# EAGLE design fever meter v2 (EAGLE 9.3.0)
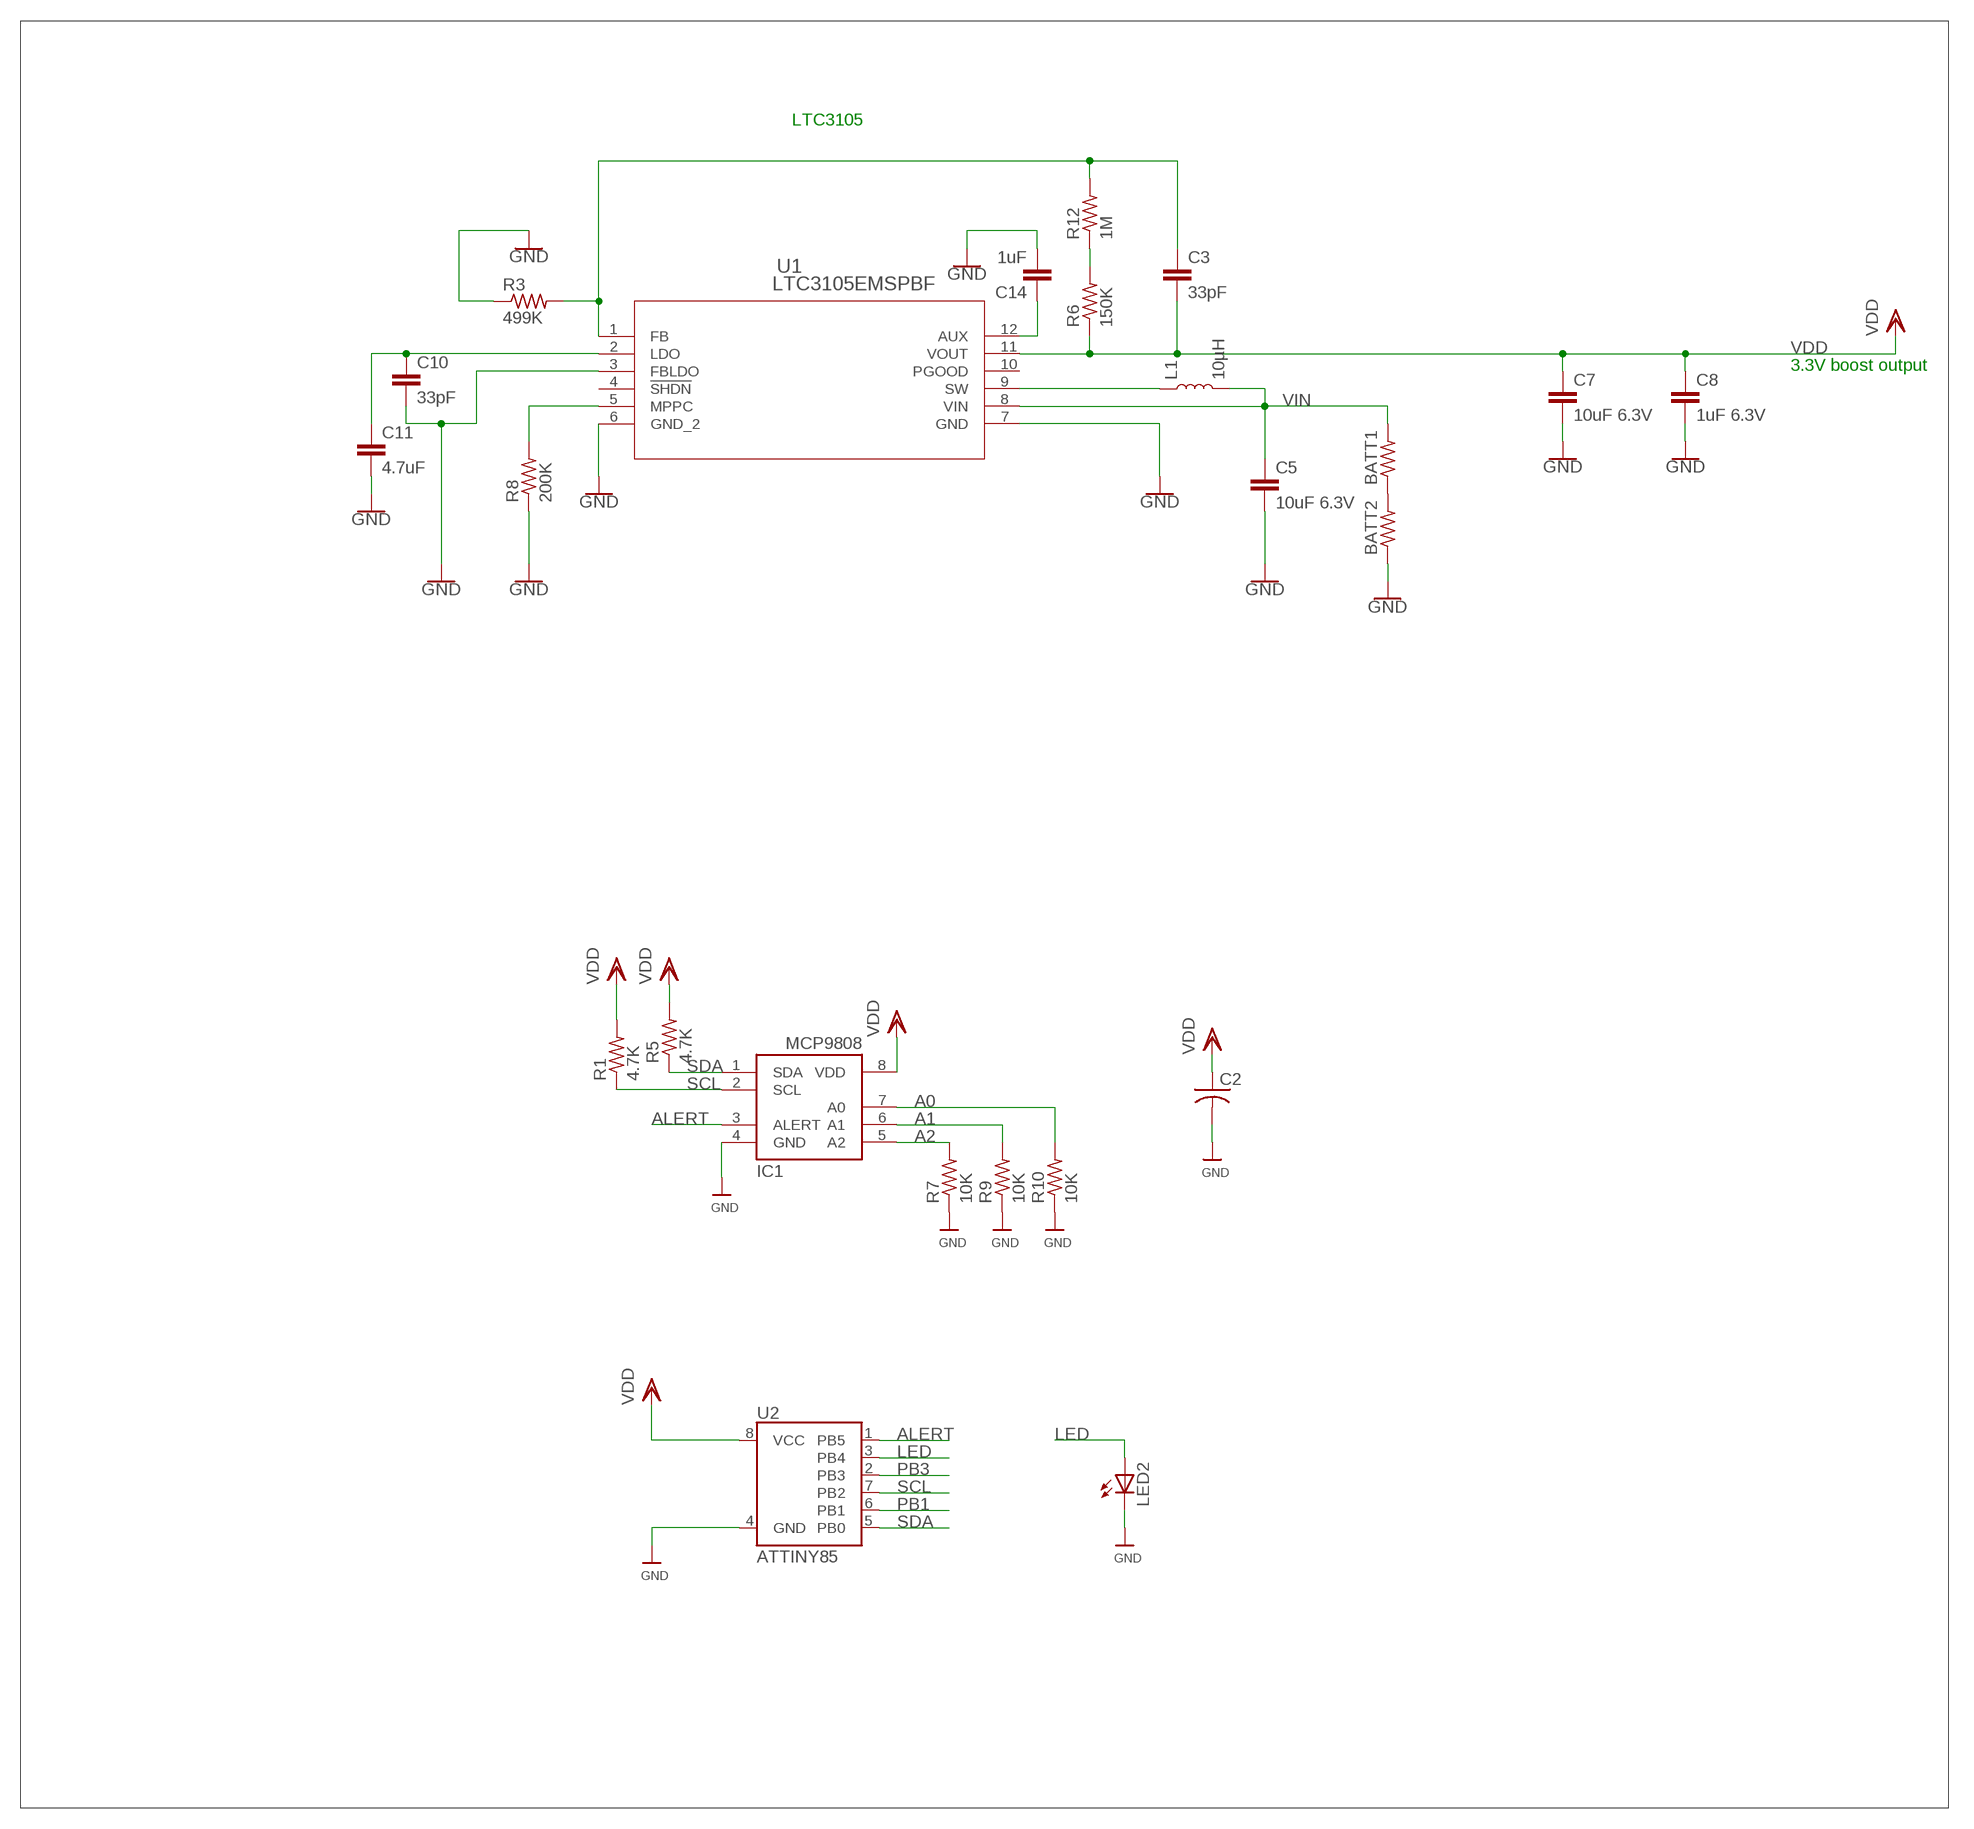
[diagram p0: schematic, sheet 1]

## Parts
BATT1  R-US_M0805  [M0805]
BATT2  R-US_M0805  [M0805]
C2  C-USC1206  [C1206]
C3  33pF  2.2UF-1206-50V-10%  [1206]
C5  10uF 6.3V  2.2UF-1206-50V-10%  [1206]
C7  10uF 6.3V  2.2UF-1206-50V-10%  [1206]
C8  1uF 6.3V  2.2UF-1206-50V-10%  [1206]
C10  33pF  2.2UF-1206-50V-10%  [1206]
C11  4.7uF  2.2UF-1206-50V-10%  [1206]
C14  1uF  2.2UF-1206-50V-10%  [1206]
IC1  MCP9808-E/MS  [MSOP8_0.65MM]
L1  10µH  INDUCTOR-VLF4012AT-2.2UH  [INDUCTOR_2.2UH]
LED2  LEDSMT1206  [1206]
R1  4.7K  R-US_M1206  [M1206]
R3  499K  R-US_R1206  [R1206]
R5  4.7K  R-US_M1206  [M1206]
R6  150K  R-US_R1206  [R1206]
R7  10K  R-US_M1206  [M1206]
R8  200K  R-US_R1206  [R1206]
R9  10K  R-US_M1206  [M1206]
R10  10K  R-US_M1206  [M1206]
R12  1M  R-US_R1206  [R1206]
U1  LTC3105EMSPBF  [MSOP-12_MS]
U2  ATTINY85  [ATTINY85]

## Nets
A0: IC1.7(A0) R10.2
A1: IC1.6(A1) R9.2
A2: IC1.5(A2) R7.2
ALERT: IC1.3(ALERT) U2.1(PB5)
AUX: C14.1 U1.12(AUX)
FB: C3.1 R3.2 R12.2 U1.1(FB)
GND: BATT2.1 C2.2 C5.2 C7.2 C8.2 C10.2 C11.2 C14.2 IC1.4(GND) LED2.C R3.1 R7.1 R8.1 R9.1 R10.1 U1.3(FBLDO) U1.6(GND_2) U1.7(GND) U2.4(GND)
LDO: C10.1 C11.1 U1.2(LDO)
LED: LED2.A U2.3(PB4)
MPPC: R8.2 U1.5(MPPC)
N$1: BATT1.1 BATT2.2
N$7: R6.2 R12.1
PB1: U2.6(PB1)
PB3: U2.2(PB3)
SCL: IC1.2(SCL) R1.1 U2.7(PB2)
SDA: IC1.1(SDA) R5.1 U2.5(PB0)
SW: L1.P$1 U1.9(SW)
VDD: C2.1 C3.2 C7.1 C8.1 IC1.8(VDD) R1.2 R5.2 R6.1 U1.11(VOUT) U2.8(VCC)
VIN: BATT1.2 C5.1 L1.P$2 U1.8(VIN)
Unconnected: U1.4(!SHDN) U1.10(PGOOD)

## Notes on the sheet
- LTC3105
- 3.3V boost output

## Library data of the parts
BATT1 BATT2 R1 R3 R5-R10 R12 = adafruit:R-US_: RESISTOR, American symbol
C2 = adafruit:C-US: CAPACITOR, American symbol
C3 C5 C7 C8 C10 C11 C14 = SparkFun-Capacitors:2.2UF: 2.2µF ceramic capacitors A capacitor is a passive two-terminal electrical component used to store electrical energy temporarily in an electric field.; PROD_ID: CAP-10009; VALUE: 2.2uF
IC1 = microbuilder:MCP9808
L1 = SparkFun-Coils:INDUCTOR: Inductors Resist changes in electrical current. Basically a coil of wire. SparkFun Products: SparkFun Load Cell Amplifier - HX711 <https://www.sparkfun.com/products/13879> IOIO-OTG - V2.2 <https://www.sparkfun.com/products/13613>; PROD_ID: NDUC-09513; VALUE: 2.2µH/±20%/1.5A
LED2 = adafruit:LED: LED OSRAM: - CHIPLED LG R971, LG N971, LY N971, LG Q971, LY Q971, LO R971, LY R971 LH N974, LH R974 LS Q976, LO Q976, LY Q976 LO Q996 - Hyper CHIPLED LW Q18S LB Q993, LB Q99A, LB R99A - SideLED LS A670, LO A670, LY A670, LG A670, LP A670 LB A673, LV A673, LT A673, LW A673 LH A674 LY A675 LS A676, LA A676, LO A676, LY A676, LW A676 LS A679, LY A679, LG A679 - Hyper Micro SIDELED® LS Y876, LA Y876, LO Y876, LY Y876 LT Y87S - SmartLED LW L88C, LW L88S LB L89C, LB L89S, LG L890 LS L89K, LO L89K, LY L89K LS L896, LA L896, LO L896, LY L896 - TOPLED LS T670, LO T670, LY T670, LG T670, LP T670 LSG T670, LSP T670, LSY T670, LOP T670, LYG T670 LG T671, LOG T671, LSG T671 LB T673, LV T673, LT T673, LW T673 LH T674 LS T676, LA T676, LO T676, LY T676, LB T676, LH T676, LSB T676, LW T676 LB T67C, LV T67C, LT T67C, LS T67K, LO T67K, LY T67K, LW E67C LS E67B, LA E67B, LO E67B, LY E67B, LB E67C, LV E67C, LT E67C LW T67C LS T679, LY T679, LG T679 LS T770, LO T770, LY T770, LG T770, LP T770 LB T773, LV T773, LT T773, LW T773 LH T774 LS E675, LA E675, LY E675, LS T675 LS T776, LA T776, LO T776, LY T776, LB T776 LHGB T686 LT T68C, LB T68C - Hyper Mini TOPLED® LB M676 - Mini TOPLED Santana® LG M470 LS M47K, LO M47K, LY M47K Source: http://www.osram.convergy.de/
U1 = ltc 3105:LTC3105EMSPBF; MANUFACTURER_PART_NUMBER: ltc3105ems#pbf; VENDOR: Linear Technology
U2 = SparkFun-IC-Microcontroller:ATTINY85; PROD_ID: IC-09092

## Board
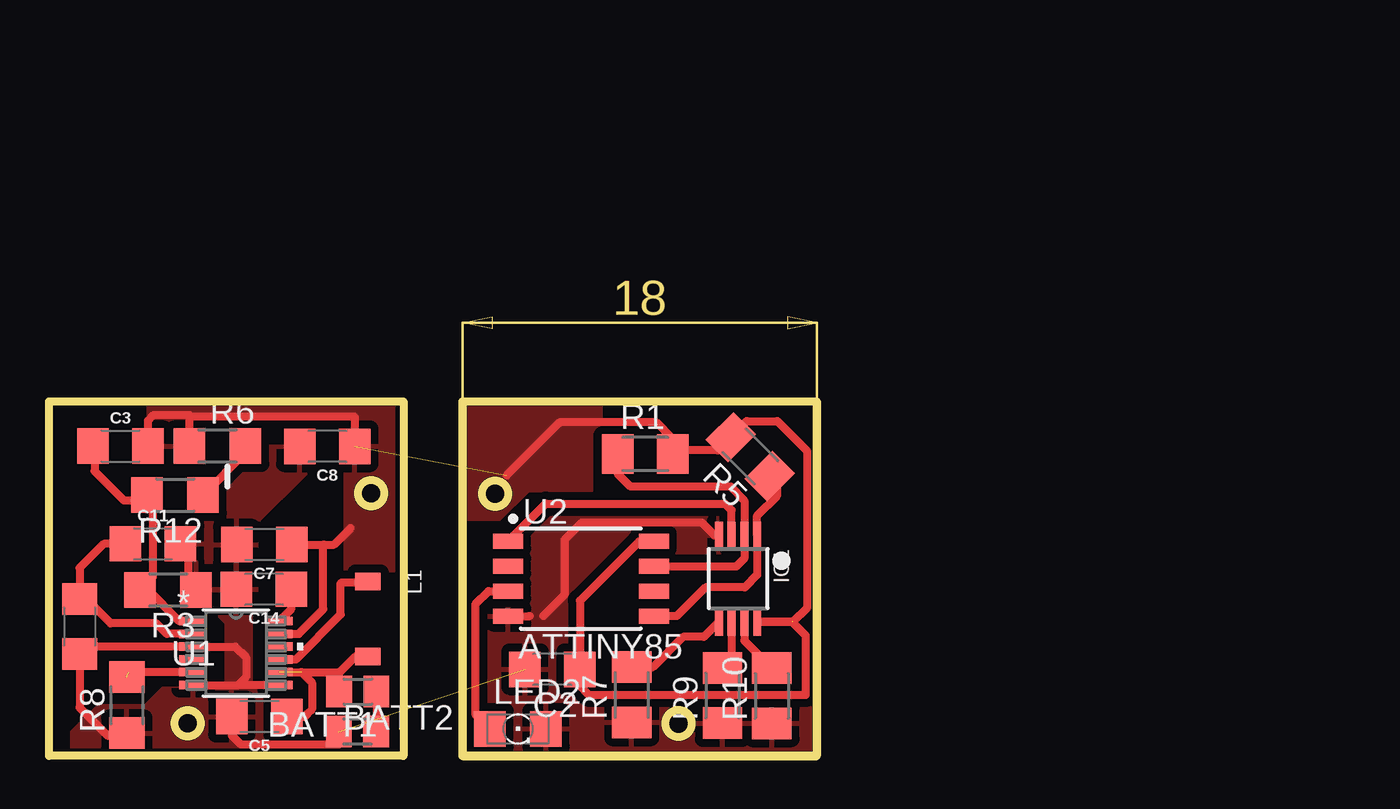
[diagram p1: board, top side]
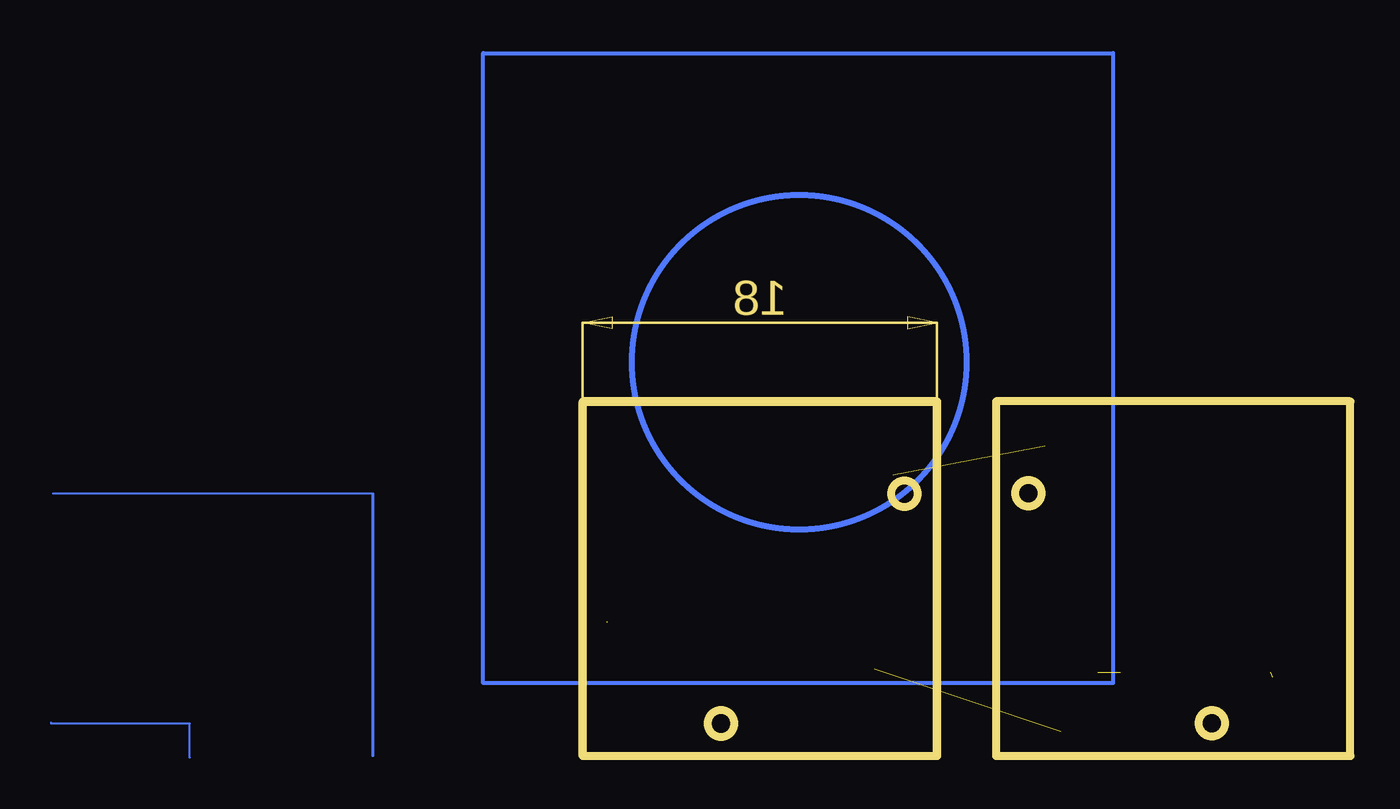
[diagram p2: board, bottom side, seen from below]

Size 39.01 x 22.31 mm. Coordinates in mm from the lower left corner, seen from the top.
Outline: 0,0.01 0,18.01 18,18.01 18,0.01 0,0.01
Outline: 21,0.01 21,18.01 39,18.01 39,0.01 21,0.01
Outline: 39.01,0 39.01,18 21.01,18 21.01,0 39.01,0
Outline: circle at 7.03,1.66 radius 0.66
Outline: circle at 16.35,13.34 radius 0.66
Outline: circle at 31.98,1.65 radius 0.66
Outline: circle at 22.66,13.33 radius 0.66
Copper layers (1*16): Top 0.035mm / dielectric 1.5mm / Bottom 0.035mm
Design rules "jonah *": minimum track width 16mil, minimum drill 16mil, track to track 16mil, track to pad 16mil, pad to pad 16mil, via to via 16mil, smd to smd 16mil, copper to edge 1mil, drill to drill 1mil, minimum pad ring 0.1mm, minimum via ring 8mil, stop-mask expansion 0.4mm, vias tented up to drill 0mil, thermal gap 0.4mm

### Footprints (pad centres in the part's own frame; a part is rotated, then mirrored left to right if it is on the bottom)
M0805 = smd 1.3 x 1.6: 1 -0.95,0; 2 0.95,0
C1206 = smd 1.6 x 1.8: 1 -1.4,0; 2 1.4,0
1206 = smd 1.6 x 1.8: 1 -1.4,0; 2 1.4,0
MSOP8_0.65MM = smd 0.4 x 1.4: 1 -0.975,-2.2; 2 -0.325,-2.2; 3 0.325,-2.2; 4 0.975,-2.2; 5 0.975,2.2; 6 0.325,2.2; 7 -0.325,2.2; 8 -0.975,2.2
INDUCTOR_2.2UH = smd 0.9 x 1.3: P$1 -1.9,0; P$2 1.9,0
1206' = smd 1.6 x 1.803: A -1.422,0; C 1.422,0
M1206 = smd 1.6 x 2: 1 -1.4,0; 2 1.4,0
R1206 = smd 1.6 x 1.803: 1 -1.422,0; 2 1.422,0
MSOP-12_MS = smd 1.397 x 0.432: 1 -2.184,1.626; 2 -2.184,0.975; 3 -2.184,0.325; 4 -2.184,-0.325; 5 -2.184,-0.975; 6 -2.184,-1.626; 7 2.184,-1.626; 8 2.184,-0.975; 9 2.184,-0.325; 10 2.184,0.325; 11 2.184,0.975; 12 2.184,1.626
ATTINY85 = smd 1.524 x 0.762: 1 -3.683,1.905; 2 -3.683,0.635; 3 -3.683,-0.635; 4 -3.683,-1.905; 5 3.727,-1.905; 6 3.727,-0.635; 7 3.727,0.635; 8 3.727,1.905

### Placement (x,y rotation side)
BATT1  15.68,3.27 180 top
BATT2  15.66,1.24 0 top
C2  25.57,4.4 180 top
C3  3.63,15.74 0 top
C5  10.68,2 180 top
C7  10.93,10.74 180 top
C8  14.13,15.73 180 top
C10  1.55,6.57 270 top
C11  5.27,10.78 0 top
C14  10.91,8.47 180 top
IC1  35,9.01 180 top
L1  16.2,6.96 270 top
LED2  [1206']  23.82,1.38 0 top
R1  30.28,15.34 0 top
R3  6.04,8.44 180 top
R5  35.62,15.21 135 top
R6  8.55,15.74 0 top
R7  29.6,3.11 90 top
R8  3.95,2.59 90 top
R9  34.21,3.07 90 top
R10  36.72,3.06 90 top
R12  6.39,13.25 180 top
U1  9.49,5.23 0 top
U2  27,9.01 0 top

### Tracks (layer width: path | path; a pad name or v marks a point on that pad's centre or on a via)
A0
  Top 0.406: IC1.7 35.33,5.85 R10.2
A1
  Top 0.406: IC1.6 34.67,4.94 R9.2
A2
  Top 0.406: IC1.5 33.27,6.05 32.22,6.05 30.67,4.51 R7.2
ALERT
  Top 0.406: U2.1 25.23,12.82 34.34,12.82 34.67,12.48 IC1.3
AUX
  Top 0.406: U1.12 12.31,7.49 C14.1
FB
  Top 0.406: U1.1 6.6,6.86 5.02,8.44 R3.2 5.27,9.09 5.27,12.99 5.17,12.99 | 5.17,12.99 R12.2 | C3.1 2.31,15.74 2.31,14.47 3.79,12.99 5.17,12.99
GND  (1 unrouted)
  Top 0.406: 9.7,2 C5.2 9.28,1.05 9.74,0.59 14.71,0.59 BATT2.1 | 7.29,5.57 U1.3 | U1.3 1.93,5.56 C10.2 1.55,2.46 3,1.01 3.16,1.17 R8.1 | 24.36,7.1 U2.4 24.42,7.1 | 25.09,7.1 26.21,8.22 26.21,11 27.06,11.85 33.16,11.85 33.8,11.21 IC1.4 | R10.1 | R7.1 29.64,1.67 | U1.3 9.46,5.56 10,5.01 10,4.01 9.59,3.6 | U1.6 9.59,3.6 | U1.7 9.59,3.6 | R3.1 7.46,8.75 7.06,9.15 7.06,10.39 C11.2
  pour Top: 8.98,3.39 8.98,6.73 7.2,8.51 7.2,15.76 13.17,15.76 13.17,14.45 10.55,11.83 10.55,7.49 10.26,7.2 10.26,2.42 8.99,2.42 8.98,3.37 8.98,3.38 8.97,3.38
  pour Top: 5.76,3.49 4.86,2.59 2.46,2.59 1.09,1.22 1.09,0.44 13.06,0.44 13.06,1.59 12.41,2.24 12.41,2.81 11.58,3.43 11.66,3.43
  pour Top: 21,18.01 39,18.01 39,0.01 21,0.01
  pour Top: 24.04,2.5 23.98,2.44 23.98,0.27 38.7,0.27 38.76,0.21 38.76,2.5 38.78,2.52
LDO
  Top 0.406: U1.2 5.97,6.21 5.44,6.74 3.12,6.74 1.55,8.31 C10.1 1.55,9.56 2.77,10.78 C11.1
LED
  Top 0.406: LED2.A 21.65,2.13 21.65,7.71 22.32,8.37 U2.3
MPPC  (1 unrouted)
  Top 0.406: U1.5 4.04,4.25
N$1
  Top 0.406: BATT1.1 16.63,1.26 BATT2.2
N$2
  Bottom 0.1: 49.65,13.33 49.65,0 49.68,0 49.68,13.33 65.92,13.33
N$3
  Bottom 0.1: 58.99,1.64 58.99,-0.07 58.96,-0.07 58.96,1.64 66.01,1.64 66.01,1.7
N$7
  Top 0.406: R6.2 9.91,15.46 10.02,15.46 R12.1
N$12
  Bottom 0.2: 44.06,3.7 44.06,35.7 12.06,35.7 12.06,3.7 44.06,3.7
SCL
  Top 0.406: U2.7 30.76,9.62 34.91,9.62 35.33,10.03 IC1.2 35.33,12.97 34.63,13.68 29.54,13.68 28.88,14.34 R1.1
SDA
  Top 0.406: U2.5 31.88,7.1 33.35,8.57 35.35,8.57 35.98,9.19 IC1.1 35.98,12.21 36.97,13.21 36.97,13.86 R5.1
SW
  Top 0.406: 16.2,8.81 L1.P$1 16.14,8.8 14.82,8.8 14.82,7.19 12.54,4.9 U1.9
VDD  (2 unrouted)
  Top 0.406: U1.11 12.68,6.21 13.93,7.46 13.93,10.72 13.95,10.74 | 15.31,11.58 14.47,10.74 13.95,10.74 | R5.2 34.63,16.17 33.98,15.52 31.86,15.52 R1.2 31.68,16.12 30.85,16.95 25.94,16.95 23.25,14.26 | U2.8 30.7,10.89 29.96,10.89 26.97,7.89 C2.1 26.97,3.56 27.44,3.09 38.43,3.09 38.43,6.12 37.74,6.81 IC1.8 | C7.1 13.95,10.74 | R6.1 7.13,17.25 | 7.13,17.25 7.13,17.32 5.31,17.32 5.03,17.04 C3.2 | 7.13,17.25 15.51,17.25 15.51,15.75 C8.1 | R5.2 34.99,16.56 | 36.13,6.81 37.8,6.81 38.49,7.5 38.49,15.52 37,17.01 35.44,17.01 R5.2
  pour Top: 15,9.36 15,17.36 7.88,17.36 6.57,16.05 6.57,15.07 5,15.07 5,18.01 17.53,18.01 17.53,9.36
  pour Top: 22,12.01 22.92,12.01 24.37,13.46 27.6,13.46 27.6,16.43 28.08,16.91 28.08,17.73 28.1,17.75 21.28,17.75 21.26,17.73 21.26,11.99 21.96,11.99 21.98,12.01
VIN  (1 unrouted)
  Top 0.406: U1.8 14.76,4.25 | C5.1 12.98,2 13.14,2.17 | 13.14,2.17 13.35,2.38 13.35,3.72 12.82,4.26 | 13.14,2.17 13.14,2.15 13,2.01 | BATT1.2 14.73,4.22 14.76,4.25 | 14.76,4.25 15.57,5.06 L1.P$2
(copper drawn outside any net)
  shapes: Bottom circle x1